# EAGLE schematic Imprimir (EAGLE 7.5.0)
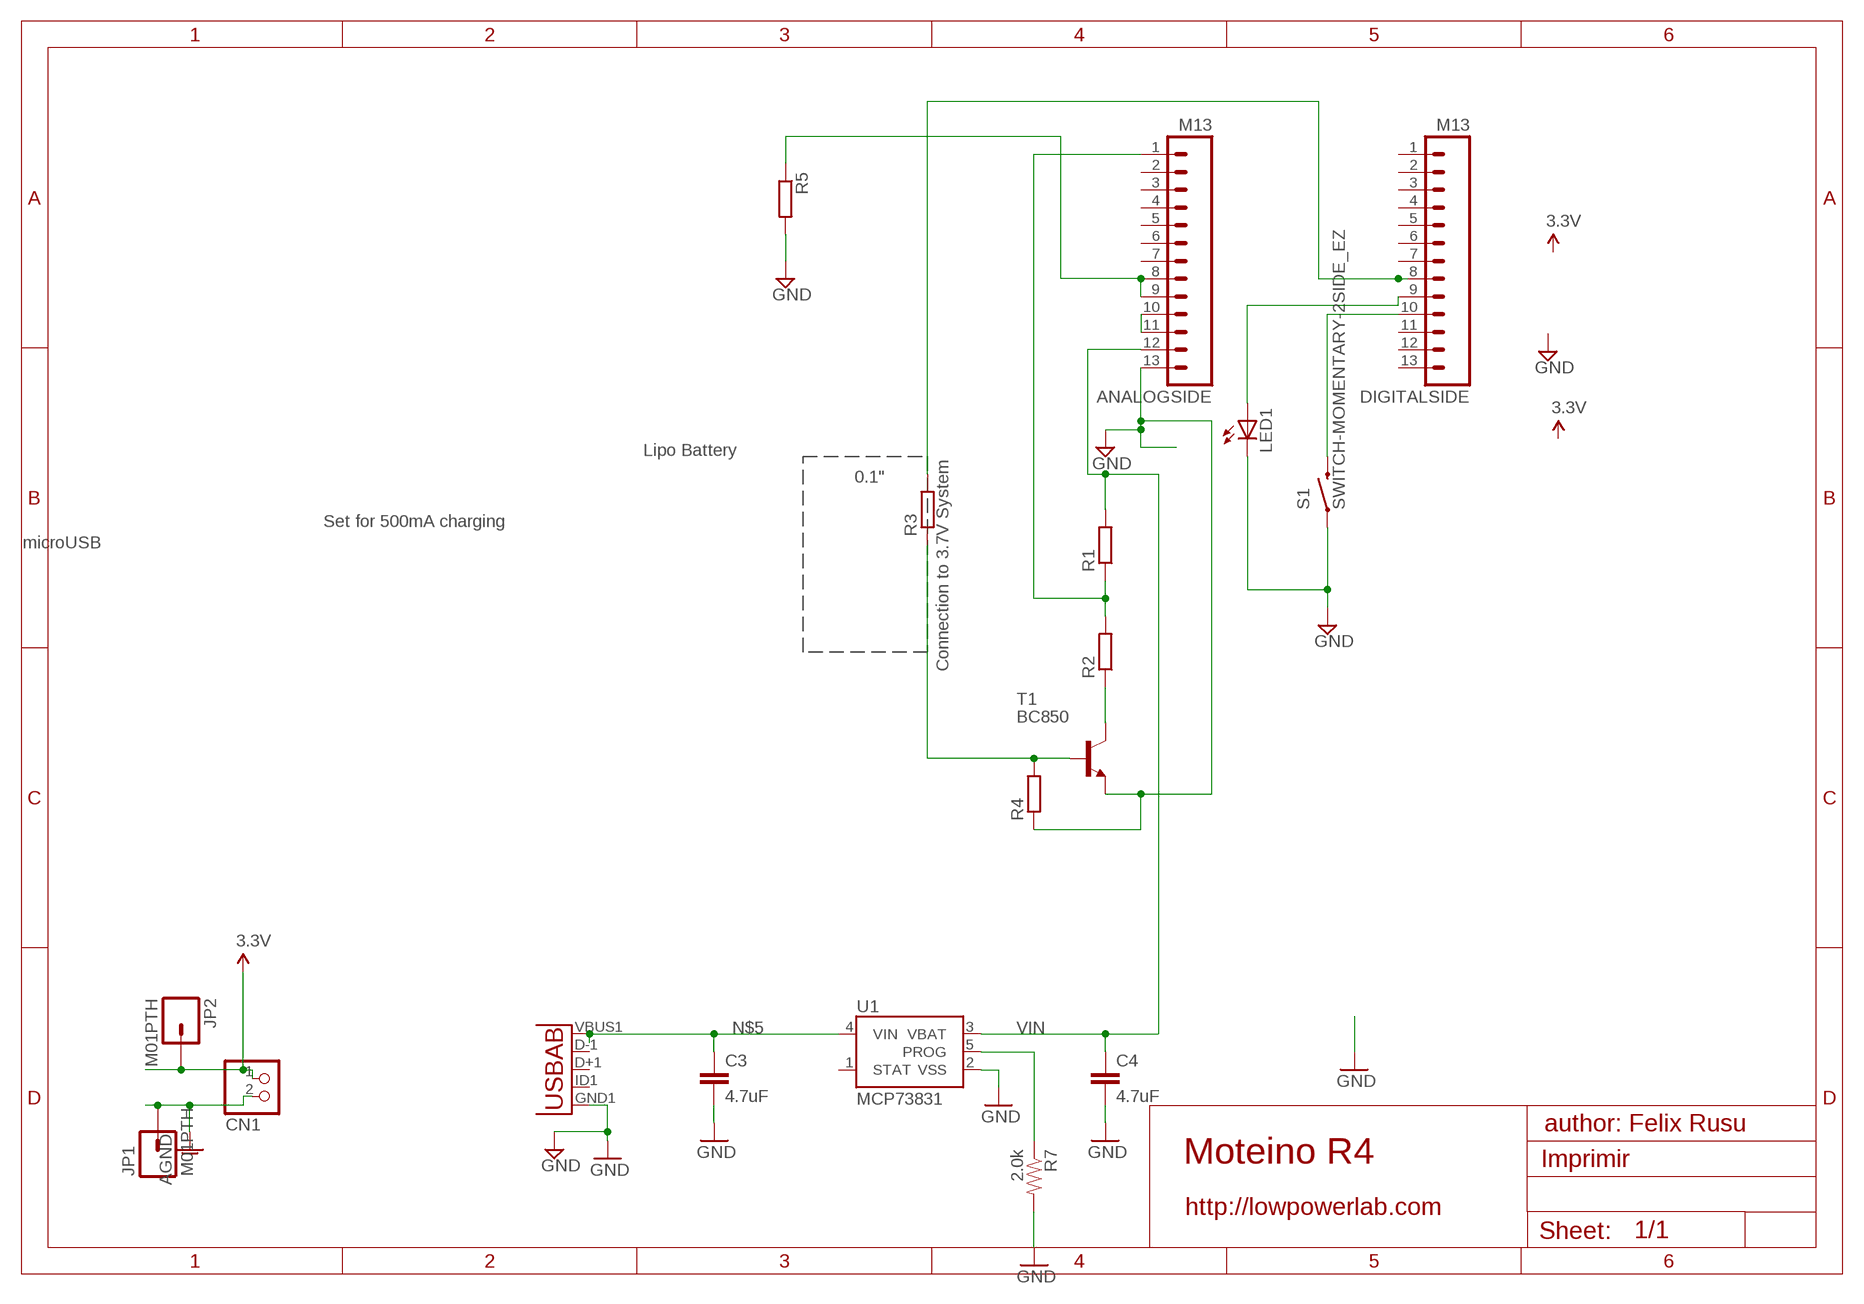
[diagram p0: schematic, sheet 1]

## Parts
ANALOGSIDE  M13  [1X13]
C3  4.7uF  4.7UF-6.3V-10%(0603)0603  [0603-CAP]
C4  4.7uF  4.7UF-6.3V-10%(0603)0603  [0603-CAP]
CN1  JST_2PIN-SMT  [JST-PH-2-SMT]
DIGITALSIDE  M13  [1X13]
JP1  M01PTH  [1X01]
JP2  M01PTH  [1X01]
JP9  Micro USB  USB-ABCONN-11794  [USB-AB-MICRO-SMD_V03]
LED1  LED3MM  [LED3MM]
R1  R-EU_0204/7  [0204/7]
R2  R-EU_0204/7  [0204/7]
R3  R-EU_M1206  [M1206]
R4  R-EU_M1206  [M1206]
R5  R-EU_0204/7  [0204/7]
R7  2.0k  2.0KOHM1/10W5%(0603)  [0603-RES]
S1  SWITCH-MOMENTARY-2SIDE_EZ  [TACTILE-PTH-SIDEEZ]
T1  BC850  [SOT23]
U1  MCP73831  [SOT23-5]

## Nets
AGND [power]: CN1.2 JP1.1
GND [power]: ANALOGSIDE.13 C3.2 C4.2 JP9.GND1(GND) LED1.K(C) R4.1 R5.2 R7.2 S1.1 T1.2(E) U1.2(VSS)
N$1: DIGITALSIDE.10 S1.2
N$3: DIGITALSIDE.9 LED1.A
N$4: ANALOGSIDE.10 ANALOGSIDE.11
N$5: C3.1 JP9.VBUS1(VBUS) U1.4(VIN)
N$6: ANALOGSIDE.1 R1.1 R2.2
N$7: R2.1 T1.3(C)
N$8: R3.1 R4.2 T1.1(B)
N$9: DIGITALSIDE.8 R3.2
N$10 [power]: ANALOGSIDE.8 ANALOGSIDE.9 R5.1
PROG: R7.1 U1.5(PROG)
VCC: CN1.1 JP2.1 ; supply symbol labelled 3.3V
VIN: ANALOGSIDE.12 C4.1 R1.2 U1.3(VBAT)
Unconnected: ANALOGSIDE.2 ANALOGSIDE.3 ANALOGSIDE.4 ANALOGSIDE.5 ANALOGSIDE.6 ANALOGSIDE.7 DIGITALSIDE.1 DIGITALSIDE.2 DIGITALSIDE.3 DIGITALSIDE.4 DIGITALSIDE.5 DIGITALSIDE.6 DIGITALSIDE.7 DIGITALSIDE.11 DIGITALSIDE.12 DIGITALSIDE.13 JP9.D+1(D+) JP9.D-1(D-) JP9.ID1(USBID) U1.1(STAT)

## Notes on the sheet
- Lipo Battery
- 0.1"
- Set for 500mA charging
- microUSB
- Connection to 3.7V System
- author: Felix Rusu
- Moteino R4
- http://lowpowerlab.com

## Library data of the parts
ANALOGSIDE DIGITALSIDE = SparkFun-Connectors:M13: 13-pin single row .1" header
C3 C4 = SparkFun-Capacitors:4.7UF-6.3V-10%(0603): CAP-08280; PROD_ID: CAP-08280
CN1 = adafruit:JST_2PIN: JST 2-Pin Connectors of various flavors SMT-RA (S2B-PH-SM4) 4UConnector #17311 SMT (B2B-PH-SM4) THM-RA (S2B-PH) THM (B2B-PH)
JP1 JP2 = SparkFun-Connectors:M01: Header 1 Standard 1-pin 0.1" header. Use with straight break away headers (SKU : PRT-00116), right angle break away headers (PRT-00553), swiss pins (PRT-00743), machine pins (PRT-00117), and female headers (PRT-00115).
JP9 = SparkFun-Connectors:USB-AB: This is a USB AB connector that is compatible with USB OTG. i.e. this connector can serve as a host or device; PROD_ID: CONN-11794
LED1 = led:LED: LED OSRAM: - CHIPLED LG R971, LG N971, LY N971, LG Q971, LY Q971, LO R971, LY R971 LH N974, LH R974 LS Q976, LO Q976, LY Q976 LO Q996 - Hyper CHIPLED LW Q18S LB Q993, LB Q99A, LB R99A - SideLED LS A670, LO A670, LY A670, LG A670, LP A670 LB A673, LV A673, LT A673, LW A673 LH A674 LY A675 LS A676, LA A676, LO A676, LY A676, LW A676 LS A679, LY A679, LG A679 - Hyper Micro SIDELED® LS Y876, LA Y876, LO Y876, LY Y876 LT Y87S - SmartLED LW L88C, LW L88S LB L89C, LB L89S, LG L890 LS L89K, LO L89K, LY L89K LS L896, LA L896, LO L896, LY L896 - TOPLED LS T670, LO T670, LY T670, LG T670, LP T670 LSG T670, LSP T670, LSY T670, LOP T670, LYG T670 LG T671, LOG T671, LSG T671 LB T673, LV T673, LT T673, LW T673 LH T674 LS T676, LA T676, LO T676, LY T676, LB T676, LH T676, LSB T676, LW T676 LB T67C, LV T67C, LT T67C, LS T67K, LO T67K, LY T67K, LW E67C LS E67B, LA E67B, LO E67B, LY E67B, LB E67C, LV E67C, LT E67C LW T67C LS T679, LY T679, LG T679 LS T770, LO T770, LY T770, LG T770, LP T770 LB T773, LV T773, LT T773, LW T773 LH T774 LS E675, LA E675, LY E675, LS T675 LS T776, LA T776, LO T776, LY T776, LB T776 LHGB T686 LT T68C, LB T68C - Hyper Mini TOPLED® LB M676 - Mini TOPLED Santana® LG M470 LS M47K, LO M47K, LY M47K Source: http://www.osram.convergy.de LUXEON: - LUMILED® LXK2-PW12-R00, LXK2-PW12-S00, LXK2-PW14-U00, LXK2-PW14-V00 LXK2-PM12-R00, LXK2-PM12-S00, LXK2-PM14-U00 LXK2-PE12-Q00, LXK2-PE12-R00, LXK2-PE12-S00, LXK2-PE14-T00, LXK2-PE14-U00 LXK2-PB12-K00, LXK2-PB12-L00, LXK2-PB12-M00, LXK2-PB14-N00, LXK2-PB14-P00, LXK2-PB14-Q00 LXK2-PR12-L00, LXK2-PR12-M00, LXK2-PR14-Q00, LXK2-PR14-R00 LXK2-PD12-Q00, LXK2-PD12-R00, LXK2-PD12-S00 LXK2-PH12-R00, LXK2-PH12-S00 LXK2-PL12-P00, LXK2-PL12-Q00, LXK2-PL12-R00 Source: www.luxeon.com KINGBRIGHT: KA-3528ASYC Source: www.kingbright.com
R1-R5 = rcl:R-EU_: RESISTOR, European symbol
R7 = SparkFun-Resistors:2.0KOHM1/10W5%(0603): RES-08296; PROD_ID: RES-08296
S1 = SparkFun-Electromechanical:SWITCH-MOMENTARY-2: Various NO switches- pushbuttons, reed, etc
T1 = transistor:BC850: NPN TRANSISTOR
U1 = SparkFun-PowerIC:MCP73831: Miniature single cell, fully integrated Li-Ion, Li-polymer charge management controller http://ww1.microchip.com/downloads/en/DeviceDoc/21984a.pdf IC-09995; PROD_ID: IC-09995

## Net classes
1 power: width 0.381 mm, clearance 0.254 mm